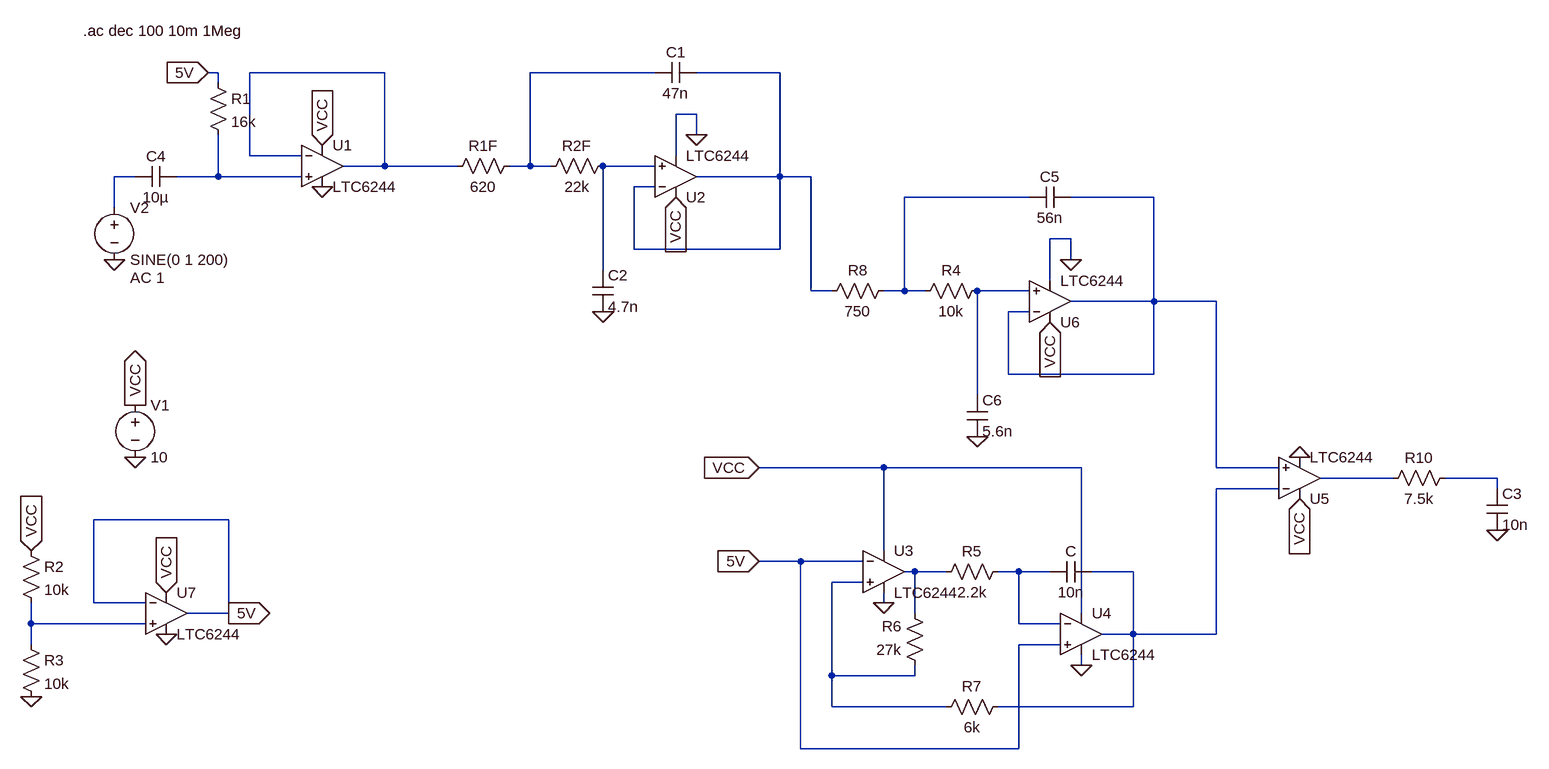
[diagram p0: schematic CombinedInput_CapBias_ActiveLPF.asc]
CombinedInput_CapBias_ActiveLPF.asc, the LTspice schematic file:
Version 4
SHEET 1 1496 904
WIRE -544 -336 -560 -336
WIRE -288 -336 -496 -336
WIRE 128 -336 -64 -336
WIRE 320 -336 192 -336
WIRE -544 -320 -544 -336
WIRE 192 -272 160 -272
WIRE 192 -240 192 -272
WIRE -496 -208 -496 -336
WIRE -416 -208 -496 -208
WIRE 160 -208 160 -272
WIRE -288 -192 -288 -336
WIRE -288 -192 -352 -192
WIRE -176 -192 -288 -192
WIRE -64 -192 -64 -336
WIRE -64 -192 -96 -192
WIRE -32 -192 -64 -192
WIRE 128 -192 48 -192
WIRE -672 -176 -704 -176
WIRE -544 -176 -544 -240
WIRE -544 -176 -608 -176
WIRE -416 -176 -544 -176
WIRE 320 -176 320 -336
WIRE 320 -176 192 -176
WIRE 368 -176 320 -176
WIRE 128 -160 96 -160
WIRE 704 -144 512 -144
WIRE 896 -144 768 -144
WIRE -704 -128 -704 -176
WIRE 768 -80 736 -80
WIRE 96 -64 96 -160
WIRE 320 -64 320 -176
WIRE 320 -64 96 -64
WIRE 768 -48 768 -80
WIRE 48 -32 48 -192
WIRE 736 -16 736 -80
WIRE 368 0 368 -176
WIRE 400 0 368 0
WIRE 512 0 512 -144
WIRE 512 0 480 0
WIRE 544 0 512 0
WIRE 704 0 624 0
WIRE 896 16 896 -144
WIRE 896 16 768 16
WIRE 992 16 896 16
WIRE 704 32 672 32
WIRE 672 128 672 32
WIRE 896 128 896 16
WIRE 896 128 672 128
WIRE 624 160 624 0
WIRE 480 272 288 272
WIRE 784 272 480 272
WIRE 992 272 992 16
WIRE 1088 272 992 272
WIRE 1264 288 1152 288
WIRE 1424 288 1344 288
WIRE 1088 304 992 304
WIRE 1424 304 1424 288
WIRE -528 352 -736 352
WIRE 480 400 480 272
WIRE 352 416 288 416
WIRE 448 416 352 416
WIRE 528 432 512 432
WIRE 576 432 528 432
WIRE 688 432 656 432
WIRE 736 432 688 432
WIRE 864 432 800 432
WIRE 448 448 400 448
WIRE -736 480 -736 352
WIRE -656 480 -736 480
WIRE 480 480 480 464
WIRE -528 496 -528 352
WIRE -528 496 -592 496
WIRE 528 496 528 432
WIRE 784 496 784 272
WIRE -832 512 -832 480
WIRE -656 512 -832 512
WIRE 688 512 688 432
WIRE 752 512 688 512
WIRE 864 528 864 432
WIRE 864 528 816 528
WIRE 992 528 992 304
WIRE 992 528 864 528
WIRE -832 544 -832 512
WIRE 752 544 688 544
WIRE 784 576 784 560
WIRE 400 592 400 448
WIRE 528 592 528 576
WIRE 528 592 400 592
WIRE 400 640 400 592
WIRE 576 640 400 640
WIRE 864 640 864 528
WIRE 864 640 656 640
WIRE 352 704 352 416
WIRE 688 704 688 544
WIRE 688 704 352 704
FLAG -672 256 0
FLAG -672 176 VCC
IOPIN -672 176 Out
FLAG 1120 320 VCC
IOPIN 1120 320 In
FLAG 1120 256 0
FLAG 480 480 0
FLAG 784 576 0
FLAG 1424 368 0
FLAG -704 -48 0
FLAG -384 -224 VCC
IOPIN -384 -224 In
FLAG -384 -160 0
FLAG 288 272 VCC
IOPIN 288 272 In
FLAG 160 -144 VCC
IOPIN 160 -144 In
FLAG 192 -240 0
FLAG 48 32 0
FLAG -832 624 0
FLAG -832 400 VCC
IOPIN -832 400 In
FLAG 288 416 5V
IOPIN 288 416 In
FLAG -560 -336 5V
IOPIN -560 -336 In
FLAG 736 48 VCC
IOPIN 736 48 In
FLAG 768 -48 0
FLAG 624 224 0
FLAG -624 464 VCC
IOPIN -624 464 In
FLAG -624 528 0
FLAG -528 496 5V
IOPIN -528 496 Out
SYMBOL voltage -672 160 R0
WINDOW 123 0 0 Left 0
WINDOW 39 0 0 Left 0
SYMATTR InstName V1
SYMATTR Value 10
SYMBOL Opamps\\LTC6244 1120 288 M180
SYMATTR InstName U5
SYMBOL res 672 416 R90
WINDOW 0 0 56 VBottom 2
WINDOW 3 32 56 VTop 2
SYMATTR InstName R5
SYMATTR Value 2.2k
SYMBOL res 544 592 R180
WINDOW 0 36 76 Left 2
WINDOW 3 36 40 Left 2
SYMATTR InstName R6
SYMATTR Value 27k
SYMBOL res 672 624 R90
WINDOW 0 0 56 VBottom 2
WINDOW 3 32 56 VTop 2
SYMATTR InstName R7
SYMATTR Value 6k
SYMBOL cap 800 416 R90
WINDOW 0 0 32 VBottom 2
WINDOW 3 32 32 VTop 2
SYMATTR InstName C
SYMATTR Value 10n
SYMBOL OpAmps\\LTC6244 480 432 R0
SYMATTR InstName U3
SYMBOL OpAmps\\LTC6244 784 528 R0
SYMATTR InstName U4
SYMBOL cap 1408 304 R0
SYMATTR InstName C3
SYMATTR Value 10n
SYMBOL res 1360 272 R90
WINDOW 0 0 56 VBottom 2
WINDOW 3 32 56 VTop 2
SYMATTR InstName R10
SYMATTR Value 7.5k
SYMBOL res -560 -336 R0
SYMATTR InstName R1
SYMATTR Value 16k
SYMBOL cap -608 -192 R90
WINDOW 0 0 32 VBottom 2
WINDOW 3 32 32 VTop 2
SYMATTR InstName C4
SYMATTR Value 10µ
SYMBOL voltage -704 -144 R0
WINDOW 123 24 124 Left 2
WINDOW 39 0 0 Left 0
SYMATTR Value2 AC 1
SYMATTR InstName V2
SYMATTR Value SINE(0 1 200)
SYMBOL OpAmps\\LTC6244 -384 -192 R0
SYMATTR InstName U1
SYMBOL OpAmps\\LTC6244 160 -176 M180
SYMATTR InstName U2
SYMBOL cap 192 -352 R90
WINDOW 0 0 32 VBottom 2
WINDOW 3 32 32 VTop 2
SYMATTR InstName C1
SYMATTR Value 47n
SYMBOL res 64 -208 R90
WINDOW 0 0 56 VBottom 2
WINDOW 3 32 56 VTop 2
SYMATTR InstName R2F
SYMATTR Value 22k
SYMBOL res -80 -208 R90
WINDOW 0 0 56 VBottom 2
WINDOW 3 32 56 VTop 2
SYMATTR InstName R1F
SYMATTR Value 620
SYMBOL cap 32 -32 R0
SYMATTR InstName C2
SYMATTR Value 4.7n
SYMBOL res -848 384 R0
SYMATTR InstName R2
SYMATTR Value 10k
SYMBOL res -848 528 R0
SYMATTR InstName R3
SYMATTR Value 10k
SYMBOL OpAmps\\LTC6244 736 16 M180
SYMATTR InstName U6
SYMBOL cap 768 -160 R90
WINDOW 0 0 32 VBottom 2
WINDOW 3 32 32 VTop 2
SYMATTR InstName C5
SYMATTR Value 56n
SYMBOL res 640 -16 R90
WINDOW 0 0 56 VBottom 2
WINDOW 3 32 56 VTop 2
SYMATTR InstName R4
SYMATTR Value 10k
SYMBOL res 496 -16 R90
WINDOW 0 0 56 VBottom 2
WINDOW 3 32 56 VTop 2
SYMATTR InstName R8
SYMATTR Value 750
SYMBOL cap 608 160 R0
SYMATTR InstName C6
SYMATTR Value 5.6n
SYMBOL OpAmps\\LTC6244 -624 496 R0
SYMATTR InstName U7
TEXT -752 -400 Left 2 !.ac dec 100 10m 1Meg

The netlist it stands for:
* CombinedInput_CapBias_ActiveLPF.asc
V1 VCC 0 10
XU5 N008 N012 VCC 0 N010 LTC6244  ; pins In+ In- V+ V- OUT
R5 N014 N013 2.2k
R6 N015 N013 27k
R7 N012 N015 6k
C N012 N014 10n
XU3 N015 5V VCC 0 N013 LTC6244  ; pins In+ In- V+ V- OUT
XU4 5V N014 VCC 0 N012 LTC6244  ; pins In+ In- V+ V- OUT
C3 N011 0 10n
R10 N011 N010 7.5k
R1 5V N006 16k
C4 N006 N005 10µ
V2 N005 0 SINE(0 1 200) AC 1
XU1 N006 N001 VCC 0 N001 LTC6244  ; pins In+ In- V+ V- OUT
XU2 N004 N003 VCC 0 N003 LTC6244  ; pins In+ In- V+ V- OUT
C1 N003 N002 47n
R2F N004 N002 22k
R1F N002 N001 620
C2 N004 0 4.7n
R2 VCC N016 10k
R3 N016 0 10k
XU6 N009 N008 VCC 0 N008 LTC6244  ; pins In+ In- V+ V- OUT
C5 N008 N007 56n
R4 N009 N007 10k
R8 N007 N003 750
C6 N009 0 5.6n
XU7 N016 5V VCC 0 5V LTC6244  ; pins In+ In- V+ V- OUT
.ac dec 100 10m 1Meg
.backanno
.end